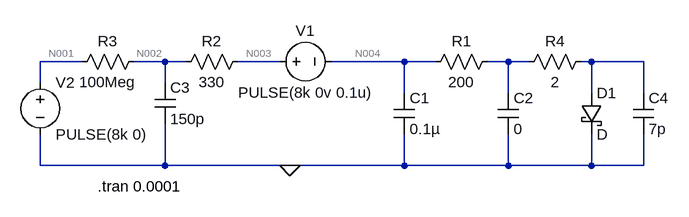
[diagram p0: schematic ESD.asc]
ESD.asc, the LTspice schematic file:
Version 4
SHEET 1 880 680
WIRE -352 112 -416 112
WIRE -224 112 -272 112
WIRE -192 112 -224 112
WIRE -48 112 -112 112
WIRE 144 112 32 112
WIRE 192 112 144 112
WIRE 304 112 272 112
WIRE 336 112 304 112
WIRE 432 112 416 112
WIRE 512 112 432 112
WIRE -416 144 -416 112
WIRE -224 144 -224 112
WIRE 144 160 144 112
WIRE 304 160 304 112
WIRE 432 160 432 112
WIRE 512 160 512 112
WIRE -416 272 -416 224
WIRE -224 272 -224 208
WIRE -224 272 -416 272
WIRE -32 272 -224 272
WIRE 144 272 144 224
WIRE 144 272 -32 272
WIRE 304 272 304 224
WIRE 304 272 144 272
WIRE 432 272 432 224
WIRE 432 272 304 272
WIRE 512 272 512 224
WIRE 512 272 432 272
FLAG -32 272 0
SYMBOL cap 128 160 R0
SYMATTR InstName C1
SYMATTR Value 0.1µ
SYMBOL res 176 128 R270
WINDOW 0 32 56 VTop 2
WINDOW 3 0 56 VBottom 2
SYMATTR InstName R1
SYMATTR Value 200
SYMBOL voltage -64 112 R270
WINDOW 0 32 56 VTop 2
WINDOW 3 -32 56 VBottom 2
WINDOW 123 0 0 Left 2
WINDOW 39 -60 56 VBottom 2
SYMATTR InstName V1
SYMATTR Value PULSE(8k 0v 0.1u)
SYMBOL voltage -416 128 R0
WINDOW 123 0 0 Left 2
WINDOW 39 24 124 Left 2
SYMATTR InstName V2
SYMATTR Value PULSE(8k 0)
SYMBOL cap -240 144 R0
SYMATTR InstName C3
SYMATTR Value 150p
SYMBOL res -96 96 R90
WINDOW 0 0 56 VBottom 2
WINDOW 3 32 56 VTop 2
SYMATTR InstName R2
SYMATTR Value 330
SYMBOL schottky 416 160 R0
SYMATTR InstName D1
SYMBOL res -256 96 R90
WINDOW 0 0 56 VBottom 2
WINDOW 3 32 56 VTop 2
SYMATTR InstName R3
SYMATTR Value 100Meg
SYMBOL cap 288 160 R0
SYMATTR InstName C2
SYMATTR Value 0
SYMBOL res 320 128 R270
WINDOW 0 32 56 VTop 2
WINDOW 3 0 56 VBottom 2
SYMATTR InstName R4
SYMATTR Value 2
SYMBOL cap 496 160 R0
SYMATTR InstName C4
SYMATTR Value 7p
TEXT -328 304 Left 2 !.tran 0.0001

The netlist it stands for:
* ESD.asc
C1 N004 0 0.1µ
R1 N004 N005 200
V1 N003 N004 PULSE(8k 0v 0.1u)
V2 N001 0 PULSE(8k 0)
C3 N002 0 150p
R2 N003 N002 330
D1 N006 0 D
R3 N002 N001 100Meg
C2 N005 0 0
R4 N005 N006 2
C4 N006 0 7p
.model D D
.lib standard.dio
.tran 0.0001
.backanno
.end

* Results of the author's LTspice run, read from the files saved beside the schematic
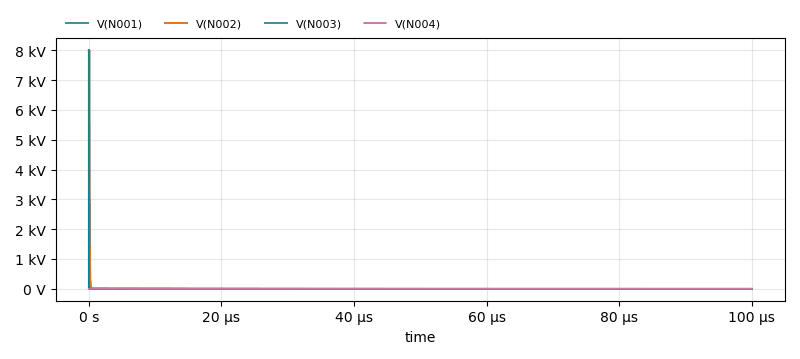
[diagram p1: Transient Analysis of ESD.asc, plotted from the saved traces]
* Transient Analysis, 1 run:
*   V(N001): min 0 V, max 8 kV, average 3.906 mV, rms 4.691 V, last 0 V
*   V(N002): min 741.4 mV, max 8 kV, average 15.03 V, rms 283.7 V, last 741.4 mV
*   V(N003): min 11.78 mV, max 8 kV, average 10.99 V, rms 253.1 V, last 741.1 mV
*   V(N004): min -45.33 µV, max 11.82 V, average 2.986 V, rms 4.119 V, last 741.1 mV